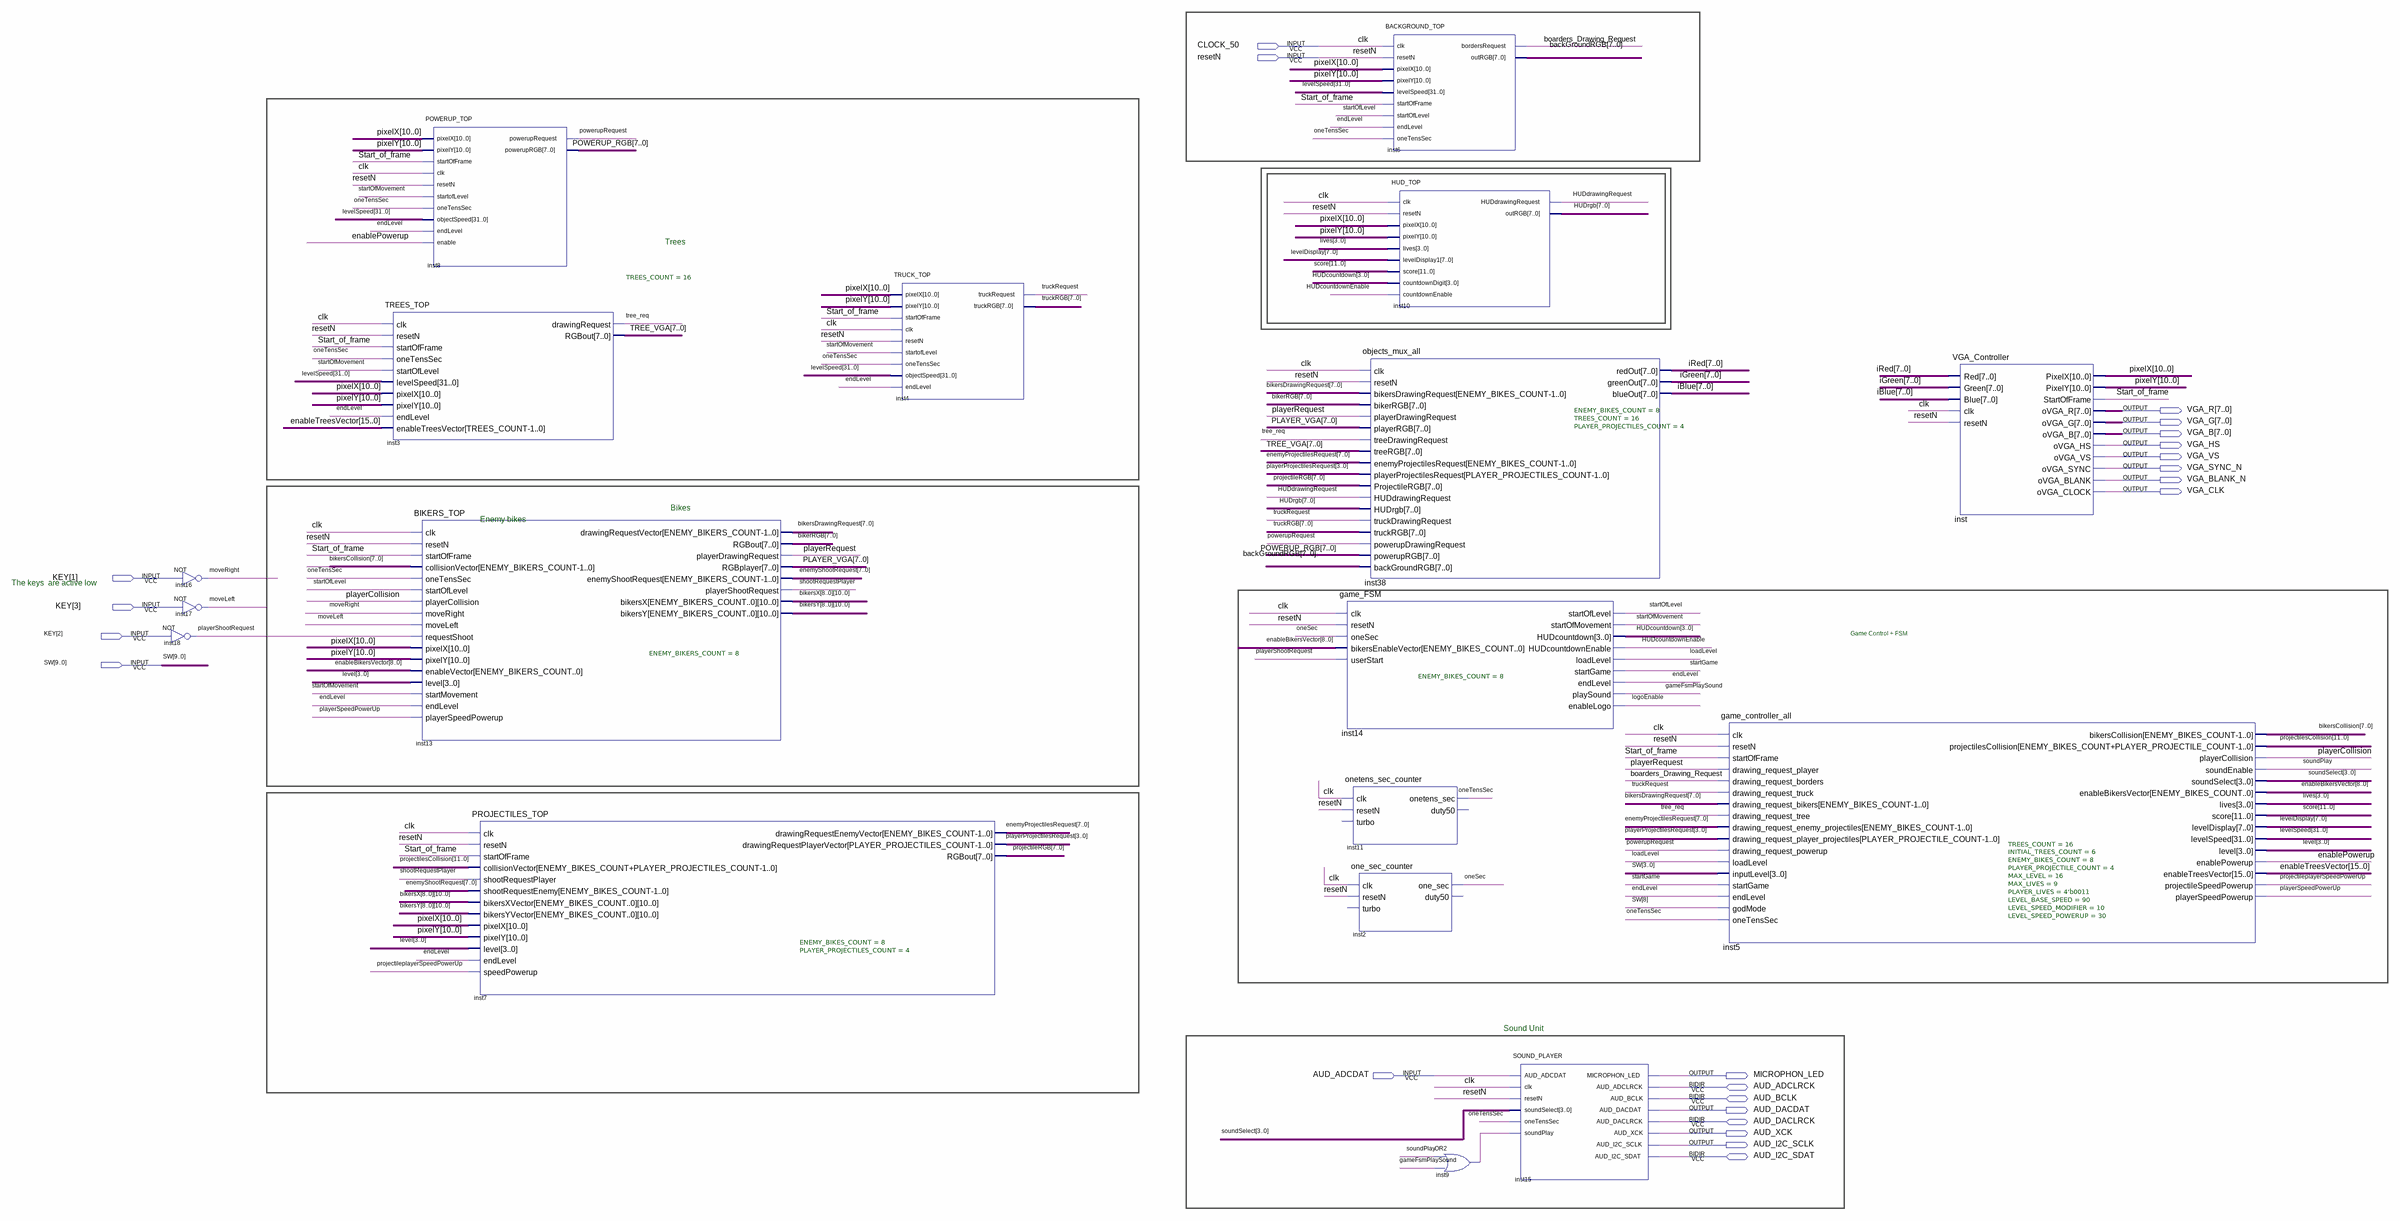
[diagram p0: schematic sheet]
// Quartus schematic MAIN_TOP.bdf as structural Verilog: 18 symbols, 23 pins
module MAIN_TOP (
  input  CLOCK_50,
  input  resetN,
  input  [3:1] KEY,
  input  [9:0] SW,
  input  AUD_ADCDAT,
  inout  AUD_ADCLRCK,
  inout  AUD_BCLK,
  inout  AUD_DACLRCK,
  inout  AUD_I2C_SDAT,
  output [7:0] VGA_R,
  output [7:0] VGA_G,
  output [7:0] VGA_B,
  output VGA_HS,
  output VGA_VS,
  output VGA_SYNC_N,
  output VGA_BLANK_N,
  output VGA_CLK,
  output MICROPHON_LED,
  output AUD_DACDAT,
  output AUD_XCK,
  output AUD_I2C_SCLK
);

  wire boarders_Drawing_Request, enablePowerup, endLevel, gameFsmPlaySound, HUDcountdownEnable,
       HUDdrawingRequest, inst9_out, loadLevel, logoEnable, moveLeft, moveRight, oneSec, oneTensSec,
       playerCollision, playerRequest, playerShootRequest, playerSpeedPowerUp, powerupRequest,
       projectileplayerSpeedPowerUp, shootRequestPlayer, soundPlay, Start_of_frame, startGame, startOfLevel,
       startOfMovement, tree_req, truckRequest;
  wire [3:0] HUDcountdown, level, lives, playerProjectilesRequest, soundSelect;
  wire [7:0] backGroundRGB, bikerRGB, bikersCollision, bikersDrawingRequest, enemyProjectilesRequest,
       enemyShootRequest, HUDrgb, iBlue, iGreen, iRed, levelDisplay, PLAYER_VGA, POWERUP_RGB, projectileRGB,
       TREE_VGA, truckRGB;
  wire [8:0] enableBikersVector;
  wire [10:0] bikersX_0, bikersX_1, bikersX_2, bikersX_3, bikersX_4, bikersX_5, bikersX_6, bikersX_7,
       bikersX_8, bikersY_0, bikersY_1, bikersY_2, bikersY_3, bikersY_4, bikersY_5, bikersY_6, bikersY_7,
       bikersY_8, pixelX, pixelY;
  wire [11:0] projectilesCollision, score;
  wire [15:0] enableTreesVector;
  wire [31:0] levelSpeed;

  not inst18 (playerShootRequest, KEY[2]);
  not inst16 (moveRight, KEY[1]);
  not inst17 (moveLeft, KEY[3]);
  TREES_TOP #(.TREES_COUNT(16)) inst3 (
    .clk(CLOCK_50), .resetN(resetN), .startOfFrame(Start_of_frame), .oneTensSec(oneTensSec),
    .startOfLevel(startOfMovement), .levelSpeed(levelSpeed), .pixelX(pixelX), .pixelY(pixelY),
    .endLevel(endLevel), .enableTreesVector(enableTreesVector), .drawingRequest(tree_req), .RGBout(TREE_VGA));
  POWERUP_TOP inst8 (
    .pixelX(pixelX), .pixelY(pixelY), .startOfFrame(Start_of_frame), .clk(CLOCK_50), .resetN(resetN),
    .startofLevel(startOfMovement), .oneTensSec(oneTensSec), .objectSpeed(levelSpeed), .endLevel(endLevel),
    .enable(enablePowerup), .powerupRequest(powerupRequest), .powerupRGB(POWERUP_RGB));
  BIKERS_TOP #(.ENEMY_BIKERS_COUNT(8)) inst13 (
    .clk(CLOCK_50), .resetN(resetN), .startOfFrame(Start_of_frame), .collisionVector(bikersCollision),
    .oneTensSec(oneTensSec), .startOfLevel(startOfLevel), .playerCollision(playerCollision),
    .moveRight(moveRight), .moveLeft(moveLeft), .requestShoot(playerShootRequest), .pixelX(pixelX),
    .pixelY(pixelY), .enableVector(enableBikersVector), .level(level), .startMovement(startOfMovement),
    .endLevel(endLevel), .playerSpeedPowerup(playerSpeedPowerUp),
    .drawingRequestVector(bikersDrawingRequest), .RGBout(bikerRGB), .playerDrawingRequest(playerRequest),
    .RGBplayer(PLAYER_VGA), .enemyShootRequest(enemyShootRequest), .playerShootRequest(shootRequestPlayer),
    .bikersX({bikersX_8, bikersX_7, bikersX_6, bikersX_5, bikersX_4, bikersX_3, bikersX_2, bikersX_1, bikersX_0}),
    .bikersY({bikersY_8, bikersY_7, bikersY_6, bikersY_5, bikersY_4, bikersY_3, bikersY_2, bikersY_1, bikersY_0}));
  PROJECTILES_TOP #(.ENEMY_BIKES_COUNT(8), .PLAYER_PROJECTILES_COUNT(4)) inst7 (
    .clk(CLOCK_50), .resetN(resetN), .startOfFrame(Start_of_frame), .collisionVector(projectilesCollision),
    .shootRequestPlayer(shootRequestPlayer), .shootRequestEnemy(enemyShootRequest),
    .bikersXVector({bikersX_8, bikersX_7, bikersX_6, bikersX_5, bikersX_4, bikersX_3, bikersX_2, bikersX_1, bikersX_0}),
    .bikersYVector({bikersY_8, bikersY_7, bikersY_6, bikersY_5, bikersY_4, bikersY_3, bikersY_2, bikersY_1, bikersY_0}),
    .pixelX(pixelX), .pixelY(pixelY), .level(level), .endLevel(endLevel),
    .speedPowerup(projectileplayerSpeedPowerUp), .drawingRequestEnemyVector(enemyProjectilesRequest),
    .drawingRequestPlayerVector(playerProjectilesRequest), .RGBout(projectileRGB));
  TRUCK_TOP inst4 (
    .pixelX(pixelX), .pixelY(pixelY), .startOfFrame(Start_of_frame), .clk(CLOCK_50), .resetN(resetN),
    .startofLevel(startOfMovement), .oneTensSec(oneTensSec), .objectSpeed(levelSpeed), .endLevel(endLevel),
    .truckRequest(truckRequest), .truckRGB(truckRGB));
  objects_mux_all #(.ENEMY_BIKES_COUNT(8), .TREES_COUNT(16), .PLAYER_PROJECTILES_COUNT(4)) inst38 (
    .clk(CLOCK_50), .resetN(resetN), .bikersDrawingRequest(bikersDrawingRequest), .bikerRGB(bikerRGB),
    .playerDrawingRequest(playerRequest), .playerRGB(PLAYER_VGA), .treeDrawingRequest(tree_req),
    .treeRGB(TREE_VGA), .enemyProjectilesRequest(enemyProjectilesRequest),
    .playerProjectilesRequest(playerProjectilesRequest), .ProjectileRGB(projectileRGB),
    .HUDdrawingRequest(HUDdrawingRequest), .HUDrgb(HUDrgb), .truckDrawingRequest(truckRequest),
    .truckRGB(truckRGB), .powerupDrawingRequest(powerupRequest), .powerupRGB(POWERUP_RGB),
    .backGroundRGB(backGroundRGB), .redOut(iRed), .greenOut(iGreen), .blueOut(iBlue));
  game_FSM #(.ENEMY_BIKES_COUNT(8)) inst14 (
    .clk(CLOCK_50), .resetN(resetN), .oneSec(oneSec), .bikersEnableVector(enableBikersVector),
    .userStart(playerShootRequest), .startOfLevel(startOfLevel), .startOfMovement(startOfMovement),
    .HUDcountdown(HUDcountdown), .HUDcountdownEnable(HUDcountdownEnable), .loadLevel(loadLevel),
    .startGame(startGame), .endLevel(endLevel), .playSound(gameFsmPlaySound), .enableLogo(logoEnable));
  onetens_sec_counter inst11 (.clk(CLOCK_50), .resetN(resetN), .onetens_sec(oneTensSec));  // open: turbo, duty50
  one_sec_counter inst2 (.clk(CLOCK_50), .resetN(resetN), .one_sec(oneSec));  // open: turbo, duty50
  BACKGROUND_TOP inst6 (
    .clk(CLOCK_50), .resetN(resetN), .pixelX(pixelX), .pixelY(pixelY), .levelSpeed(levelSpeed),
    .startOfFrame(Start_of_frame), .startOfLevel(startOfLevel), .endLevel(endLevel), .oneTensSec(oneTensSec),
    .bordersRequest(boarders_Drawing_Request), .outRGB(backGroundRGB));
  HUD_TOP inst10 (
    .clk(CLOCK_50), .resetN(resetN), .pixelX(pixelX), .pixelY(pixelY), .lives(lives),
    .levelDisplay1(levelDisplay), .score(score), .countdownDigit(HUDcountdown),
    .countdownEnable(HUDcountdownEnable), .HUDdrawingRequest(HUDdrawingRequest), .outRGB(HUDrgb));
  or inst9 (inst9_out, soundPlay, gameFsmPlaySound);
  SOUND_PLAYER inst15 (
    .AUD_ADCDAT(AUD_ADCDAT), .clk(CLOCK_50), .resetN(resetN), .soundSelect(soundSelect),
    .oneTensSec(oneTensSec), .soundPlay(inst9_out), .MICROPHON_LED(MICROPHON_LED), .AUD_DACDAT(AUD_DACDAT),
    .AUD_XCK(AUD_XCK), .AUD_I2C_SCLK(AUD_I2C_SCLK), .AUD_ADCLRCK(AUD_ADCLRCK), .AUD_BCLK(AUD_BCLK),
    .AUD_DACLRCK(AUD_DACLRCK), .AUD_I2C_SDAT(AUD_I2C_SDAT));
  game_controller_all #(.TREES_COUNT(16), .INITIAL_TREES_COUNT(6), .ENEMY_BIKES_COUNT(8), .PLAYER_PROJECTILE_COUNT(4), .MAX_LEVEL(16), .MAX_LIVES(9), .PLAYER_LIVES(4'b0011), .LEVEL_BASE_SPEED(90), .LEVEL_SPEED_MODIFIER(10), .LEVEL_SPEED_POWERUP(30)) inst5 (
    .clk(CLOCK_50), .resetN(resetN), .startOfFrame(Start_of_frame), .drawing_request_player(playerRequest),
    .drawing_request_borders(boarders_Drawing_Request), .drawing_request_truck(truckRequest),
    .drawing_request_bikers(bikersDrawingRequest), .drawing_request_tree(tree_req),
    .drawing_request_enemy_projectiles(enemyProjectilesRequest),
    .drawing_request_player_projectiles(playerProjectilesRequest), .drawing_request_powerup(powerupRequest),
    .loadLevel(loadLevel), .inputLevel(SW[3:0]), .startGame(startGame), .endLevel(endLevel), .godMode(SW[8]),
    .oneTensSec(oneTensSec), .bikersCollision(bikersCollision), .projectilesCollision(projectilesCollision),
    .playerCollision(playerCollision), .soundEnable(soundPlay), .soundSelect(soundSelect),
    .enableBikersVector(enableBikersVector), .lives(lives), .score(score), .levelDisplay(levelDisplay),
    .levelSpeed(levelSpeed), .level(level), .enablePowerup(enablePowerup),
    .enableTreesVector(enableTreesVector), .projectileSpeedPowerup(projectileplayerSpeedPowerUp),
    .playerSpeedPowerup(playerSpeedPowerUp));
  VGA_Controller inst (
    .Red(iRed), .Green(iGreen), .Blue(iBlue), .clk(CLOCK_50), .resetN(resetN), .PixelX(pixelX),
    .PixelY(pixelY), .StartOfFrame(Start_of_frame), .oVGA_R(VGA_R), .oVGA_G(VGA_G), .oVGA_B(VGA_B),
    .oVGA_HS(VGA_HS), .oVGA_VS(VGA_VS), .oVGA_SYNC(VGA_SYNC_N), .oVGA_BLANK(VGA_BLANK_N), .oVGA_CLOCK(VGA_CLK));

  // Other names for the same wires on the sheet: clk = CLOCK_50

  // Notes on the sheet:
  //   Trees
  //   Bikes
  //   Enemy bikes
  //   The keys  are active low
  //   Game Control + FSM
  //   Sound Unit
endmodule
